# Altium schematic sheet Current_measurement.SchDoc
size A4; SheetNumber: 3; SheetTotal: 9; SPICEModelCacheJBRCZOZI: <root> / <DocumentId>JBRCZOZI</DocumentId> / <CacheFrame Number="0"> / <Model Name="mcp6001" Kind="CKT"> / <Text>.SUBCKT MCP6001 1 2 3 4 5 / *               | | | | | / *               | | | | Output / *               | | | Negative Supply / *               | | Positive Supply / *               | Inverting Input / *               Non-inverting Input / * / ******************************************************************************** / * Software License Agreement                                                   * / *                                                                              * / * The software supplied herewith by Microchip Technology Incorporated (the     * / * "Company") is intended and supplied to you, the Company's customer, for use  * / * soley and exclusively on Microchip products.                                 * / *                                                                              * / * The software is owned by the Company and/or its supplier, and is protected   * / * under applicable copyright laws. All rights are reserved. Any use in         * / * violation of the foregoing restrictions may subject the user to criminal     * / * sanctions under applicable laws, as well as to civil liability for the       * / * breach of the terms and conditions of this license.                          * / *                                                                              * / * THIS SOFTWARE IS PROVIDED IN AN "AS IS" CONDITION. NO WARRANTIES, WHETHER    * / * EXPRESS, IMPLIED OR STATUTORY, INCLUDING, BUT NOT LIMITED TO, IMPLIED        * / * WARRANTIES OF MERCHANTABILITY AND FITNESS FOR A PARTICULAR PURPOSE APPLY TO  * / * THIS SOFTWARE. THE COMPANY SHALL NOT, IN ANY CIRCUMSTANCES, BE LIABLE FOR    * / * SPECIAL, INCIDENTAL OR CONSEQUENTIAL DAMAGES, FOR ANY REASON WHATSOEVER.     * / ******************************************************************************** / * / * Macromodel for the MCP6001/2/4 op amp family: / *   MCP6001, MCP6001R, MCP6001U, MCP6002, MCP6004 / * / * Revision History: / *   REV A: 21-Jun-02, Created model / *   REV B: 16-Jul-02, Improved output stage / *   REV C: 03-Jan-03, Added MCP6001 / *   REV D: 19-Aug-06, Added over temperature, improved output stage, / *                     fixed overdrive recovery time / *   REV E: 27-Jul-07, Updated output impedance for better model stability w/cap load / *   REV F: 09-Jul-12, Added MCP6001R, MCP6001U / * / * Recommendations: / *   Use PSPICE (other simulators may require translation) / *   For a quick, effective design, use a combination of: data sheet / *     specs, bench testing, and simulations with this macromodel / *   For high impedance circuits, set GMIN=100F in .OPTIONS / * / * Supported: / *   Typical performance for temperature range (-40 to 125) degrees Celsius / *   DC, AC, Transient, and Noise analyses. / *   Most specs, including: offsets, DC PSRR, DC CMRR, input impedance, / *     open loop gain, voltage ranges, supply current, ... , etc. / *   Temperature effects for Ibias, Iquiescent, Iout short circuit / *   current, Vsat on both rails, Slew Rate vs. Temp and P.S. / * / * Not Supported: / *   Some Variation in specs vs. Power Supply Voltage / *   Monte Carlo (Vos, Ib), Process variation / *   Distortion (detailed non-linear behavior) / *   Behavior outside normal operating region / * / * Input Stage / V10  3 10 -500M / R10 10 11 6.90K / R11 10 12 6.90K / C11 11 12 0.2p / C12 1  0 6.00P / E12 71 14 POLY(4) 20 0 21 0 26 0 27 0   1.00M 20.1 20.1 1 1 / G12 1 0 62 0 1m / M12 11 14 15 15 NMI L=2.00U W=42.0U / M14 12  2 15 15 NMI L=2.00U W=42.0U / G14 2 0 62 0 1m / C14  2  0 6.00P / I15 15  4 50.0U / V16 16  4 -300M / GD16 16 1 TABLE {V(16,1)} ((-100,-1p)(0,0)(1m,1n)(2m,1m)(3m,1)) / V13  3 13 -300M / GD13 2 13 TABLE {V(2,13)} ((-100,-1p)(0,0)(1m,1n)(2m,1m)(3m,1)) / R70 1 0 20.6T / R71 2 0 20.6T / R72 1 2 20T / I80 1 2 0.5p / * / * Noise, PSRR, and CMRR / I20 21 20 423U / D20 20  0 DN1 / D21  0 21 DN1 / G26  0 26 POLY(1) 3 4   110U -49U / R26 26  0 1 / G27  0 27 POLY(2) 1 0 2 0   -440U 39.7U 39.7U / R27 27  0 1 / * / * Open Loop Gain, Slew Rate / G30  0 30 POLY(1) 12 11   0 1 / R30 30  0 1K / G31  0 31 POLY(1) 3 4 86 5.25 / R31 31  0 1 TC=2.8m / GD31 30 31 TABLE {V(30,31)} ((-11,-1)(-10,-10n)(0,0)(1m,1000)) / G32 32  0 POLY(1) 3 4 113.7 3.5 / R32 32  0 1 TC=2.65m / GD32 30 32 TABLE {V(30,32)} ((-1m,-1000)(0,0)(10,10n)(11,1)) / G33 0 33 30 0 1m / R33 33 0 1k / G34  0 34 33 0 425M / R34  34 0 1K / C34  34 0 74U / G37  0 37 34 0 1m / R37  37 0 1K / C37  37 0 41.6P / G38  0 38 37 0 1m / R38  39 0 1K / L38  38 39 100U / E38  35 0 38 0 1 / G35 33 0 TABLE {V(35,3)} ((-1,-1n)(0,0)(16,1n))(16.1,1)) / G36 33 0 TABLE {V(35,4)} ((-16.1,-1)((-16,-1n)(0,0)(1,1n)) / * / * Output Stage / R80 50 0 100MEG / G50 0 50 57 96 2 / R58 57  96 0.50 / R57 57  0 750 / C58  5  0 2.00P / G57  0 57 POLY(3) 3 0 4 0 35 0   0 0.67M 0.67M 1.5M / GD55 55 57 TABLE {V(55,57)} ((-2m,-1)(-1m,-1m)(0,0)(10,1n)) / GD56 57 56 TABLE {V(57,56)} ((-2m,-1)(-1m,-1m)(0,0)(10,1n)) / E55 55  0 POLY(2) 3 0 51 0 -0.7m 1 -40.0M / E56 56  0 POLY(2) 4 0 52 0 1.2m 1 -37.0M / R51 51 0 1k / R52 52 0 1k / GD51 50 51 TABLE {V(50,51)} ((-10,-1n)(0,0)(1m,1m)(2m,1)) / GD52 50 52 TABLE {V(50,52)} ((-2m,-1)(-1m,-1m)(0,0)(10,1n)) / G53  3  0 POLY(1) 51 0  -49U 1M / G54  0  4 POLY(1) 52 0  -49U -1M / * / * Current Limit / G99 96 5 99 0 1 / R98 0 98 1 TC=-2.8M,2.63U / G97 0 98 TABLE { V(96,5) } ((-11.0,-10.0M)(-1.00M,-9.9M)(0,0)(1.00M,9.9M)(11.0,10.0M)) / E97 99 0 VALUE { V(98)*((V(3)-V(4))*359M + 310M)} / D98 4 5 DESD / D99 5 3 DESD / * / * Temperature / Voltage Sensitive IQuiscent / R61 0 61 100 TC 3.11M 4.51U / G61 3 4 61 0 1 / G60 0 61 TABLE {V(3, 4)} / + ((0,0)(900M,0.0106U)(1.00,0.20U)(1.3,0.63U) / + (1.5,0.66U)(1.6,1.06U)(5.5,1.10U)) / * / * Temp Sensitive offset voltage / I73 0 70 DC 1uA / R74 0 70 1 TC=2 / E75 1 71 70 0 1 / * / * Temp Sensistive IBias / I62 0 62 DC 1uA / R62 0 62 REXP 58.2u / * Voltage on R62 used for G12, G14 in input stage / * / * Models / .MODEL NMI NMOS / .MODEL DESD  D   N=1 IS=1.00E-15 / .MODEL DL  D   N=1 IS=1F / .MODEL DN1 D   IS=1P KF=146E-18 AF=1 / .MODEL REXP RES TCE=10.1 / .ENDS MCP6001</Text> / </Model> / <Model Name="smk316b7103_f-t" Kind="CKT"> / <Text>* SMK316B7103_F-T     SPICE MODEL  ( General Type ) / *-------------------------------------------------------------------------------------------------------- / * Model Generated by TAIYO YUDEN Corporation (http://www.ty-top.com) / * Version 1.0 / * TAIYO YUDEN Control No. 170508_161201 / * Copyright(c) 2012 TAIYO YUDEN CO.,LTD. All Rights Reserved. / *-------------------------------------------------------------------------------------------------------- / * / * Products Name : Multilayer Ceramic Capacitors / * / * Characteristics : / *     Capacitance : 0.01 uF , Rated Voltage : 630V , TCC : X7R / *     Case Size : 3.2 x 1.6 / 0.126 x 0.063 [mm/inch] , Thickness : 1.15 / 0.045 [mm/inch] / *     (Conditions: Temperature = 25 degC , DC Bias Current/Voltage = 0A / 0V) / * / * Frequency Range : 40Hz - 3GHz / * / * External Node Assignments : / * / *  1  o---| |---o  2 / * / *-------------------------------------------------------------------------------------------------------- / .SubCkt SMK316B7103_F-T 1 2 / **************************** / C0 1 110 9888p / Cm 1 101 398.4p / C1 101 102 1923.4p / Rc1 101 102 288.22k / C2 102 103 1016.2p / Rc2 102 103 14.114k / C3 103 110 4.0985p / Rc3 103 110 430.45 / C2m 1 301 429.64p / C21 301 302 0.05831u / Rc21 301 302 274.72k / C22 302 303 5474.8p / Rc22 302 303 613.52k / C23 303 304 3415.7p / Rc23 303 304 754.71k / C24 304 305 2829.6p / Rc24 304 305 45.094k / C25 305 306 1811.9p / Rc25 305 306 41.061k / C26 306 307 1276.1p / Rc26 306 307 2.7245k / C27 307 308 180.55p / Rc27 307 308 2.1125k / C28 308 309 583.2p / Rc28 308 309 516.69 / C29 309 110 1.724p / Rc29 309 110 368.87 / Rp0 1 110 10G / L0 110 120 0.45307n / Lm 120 130 0.21245n / L1 120 121 3.2969p / RL1 121 130 33.569 / L2 120 122 0.53999n / RL2 122 130 0.49892 / L3 120 123 3.1666n / RL3 123 130 4.2853 / CR 120 124 1050.7p / LR 124 125 0.2527n / RR 125 130 0.40977 / CL 130 140 7.2948p / LL 130 140 0.31535n / RL 130 140 12.803 / Rs 140 2 57.335m / **************************** / .ends SMK316B7103_F-T</Text> / </Model> / <Model Name="qmk325bj104_n-t" Kind="CKT"> / <Text>* QMK325BJ104_N-T     SPICE MODEL  ( General Type ) / *-------------------------------------------------------------------------------------------------------- / * Model Generated by TAIYO YUDEN Corporation (http://www.ty-top.com) / * Version 1.0 / * TAIYO YUDEN Control No. 170508_101215 / * Copyright(c) 2012 TAIYO YUDEN CO.,LTD. All Rights Reserved. / *-------------------------------------------------------------------------------------------------------- / * / * Products Name : Multilayer Ceramic Capacitors / * / * Characteristics : / *     Capacitance : 0.1 uF , Rated Voltage : 250V , TCC : B / X5R / *     Case Size : 3.2 x 2.5 / 0.126 x 0.098 [mm/inch] , Thickness : 1.9 / 0.075 [mm/inch] / *     (Conditions: Temperature = 25 degC , DC Bias Current/Voltage = 0A / 0V) / * / * Frequency Range : 40Hz - 3GHz / * / * External Node Assignments : / * / *  1  o---| |---o  2 / * / *-------------------------------------------------------------------------------------------------------- / .SubCkt QMK325BJ104_N-T 1 2 / **************************** / C0 1 110 0.09559u / Cm 1 101 3751.1p / C1 101 102 0.015822u / Rc1 101 102 51.629k / C2 102 103 7648.8p / Rc2 102 103 3.8642k / C3 103 110 450.5p / Rc3 103 110 113.97 / C2m 1 301 3919.2p / C21 301 302 0.035457u / Rc21 301 302 241.74k / C22 302 303 0.036825u / Rc22 302 303 156.05k / C23 303 304 0.038127u / Rc23 303 304 141.7k / C24 304 305 0.017837u / Rc24 304 305 8.8244k / C25 305 306 0.016301u / Rc25 305 306 9.1046k / C26 306 307 0.010066u / Rc26 306 307 717.43 / C27 307 308 1390.3p / Rc27 307 308 682.39 / C28 308 309 8928.6p / Rc28 308 309 84.912 / C29 309 110 13.208p / Rc29 309 110 119.07 / Rp0 1 110 1G / L0 110 120 0.24814n / Lm 120 130 0.27661n / RL1 120 130 181.88 / L2 120 122 0.76576n / RL2 122 130 0.73015 / L3 120 123 1.0444n / RL3 123 130 1.0157 / CR 120 124 0.022178u / LR 124 125 0.21869n / RR 125 130 0.15853 / CL 130 140 13.866p / LL 130 140 0.20298n / RL 130 140 8.1514 / Rs 140 2 13.921m / **************************** / .ends QMK325BJ104_N-T</Text> / </Model> / <Model Name="ntc_10k_1" Kind="CKT"> / <Text>.SUBCKT NTC_10K_1   1 2   4 5 / ETHERM 1 3 VALUE = { I(VSENSE)*10K*EXP( 3548/(V(4,5)+273) - 3548/(25+273) ) } / VSENSE 3 2 DC 0 / .ENDS</Text> / </Model> / </CacheFrame> / </root>
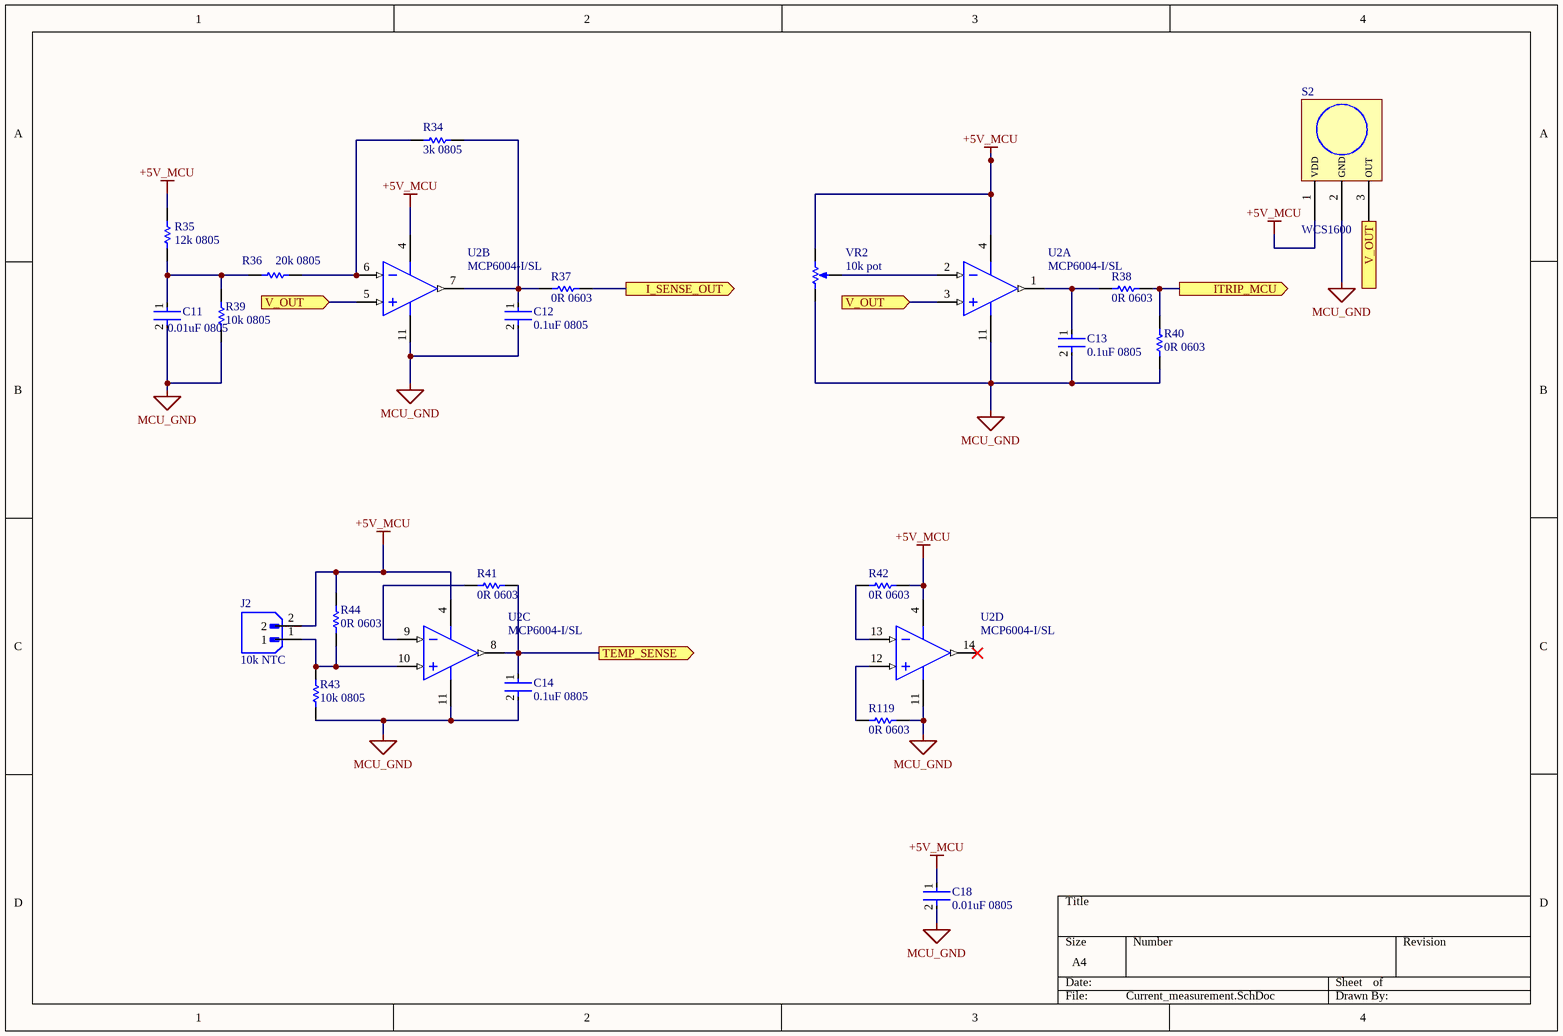
[diagram p0: Current_measurement.SchDoc]

## Parts
C11  0.01uF 0805  [R0805]
C12  0.1uF 0805  [R0805]
C13  0.1uF 0805  [R0805]
C14  0.1uF 0805  [R0805]
C18  0.01uF 0805  [R0805]
J2  10k NTC  [XH2.5-2p]
R34  3k 0805  [R0805]
R35  12k 0805  [R0805]
R36  20k 0805  [R0805]
R37  0R 0603  [R0603]
R38  0R 0603  [R0603]
R39  10k 0805  [R0805]
R40  0R 0603  [R0603]
R41  0R 0603  [R0603]
R42  0R 0603  [R0603]
R43  10k 0805  [R0805]
R44  0R 0603  [R0603]
R119  0R 0603  [R0603]
S2  WCS1600  [WCS1600]
U2  MCP6004-I/SL  [SOIC-SL14_M]  (parts A,B,C,D of 4)
VR2  10k pot  [BOUR-3299W-3_V]

## Ports
I_SENSE_OUT (out), ITRIP_MCU (out), TEMP_SENSE (out), V_OUT (in), V_OUT (out)

## Nets
+5V_MCU: C18.1 J2.2 R35.2 R42.2 R44.2 S2.1(VDD) U2.4(VDD) VR2.1(CCW)
MCU_GND: C11.2 C12.2 C13.2 C14.2 C18.2 R39.1 R40.1 R43.1 R119.2 S2.2(GND) U2.11(VSS) VR2.3(CW)
I_SENSE_OUT: R37.2 ; port I_SENSE_OUT
ITRIP_MCU: R38.2 R40.2 ; port ITRIP_MCU
TEMP_SENSE: C14.1 R41.2 U2.8(VOUTC) ; port TEMP_SENSE
V_OUT: S2.3(OUT) U2.3(VINA+) U2.5(VINB+) ; port V_OUT
NetC11_1: C11.1 R35.1 R36.1 R39.2
NetC12_1: C12.1 R34.2 R37.1 U2.7(VOUTB)
NetC13_1: C13.1 R38.1 U2.1(VOUTA)
NetJ2_1: J2.1 R43.2 R44.1 U2.10(VINC+)
NetR34_1: R34.1 R36.2 U2.6(VINB-)
NetR41_1: R41.1 U2.9(VINC-)
NetR42_1: R42.1 U2.13(VIND-)
NetR119_1: R119.1 U2.12(VIND+)
NetU2_2: U2.2(VINA-) VR2.2(WIPER)

Not connected (* = marked no-connect by the designer): U2 14(VOUTD)*

## Library data of the parts
C11 C18 = 0.01uF 0805: 10nF/0.01uF 50V Capacitor ±10% Tolerance 0805B103K500CT – 0805 Package; Product URL: https://sharvielectronics.com/product/10nf-0-01uf-50v-capacitor-%c2%b110-tolerance-0805b103k500ct-0805-package/; Price per piece: 2.45; Datasheet: https://drive.google.com/file/d/18RHnvRuuuVekgJyOA4l8O3UUaSpuKbHR/view?usp=sharing
C12-C14 = 0.1uF 0805: 0.1uF/100nF 100V Capacitor ±10% Tolerance CC0805KKX7R0BB104 – 0805 Package; Product URL: https://sharvielectronics.com/product/0-1uf-100nf-100v-capacitor-%c2%b110-tolerance-cc0805kkx7r0bb104-0805-package/; Price per piece: 4.76; Datasheet: https://drive.google.com/file/d/1wr2K_YaGqgMtACeU2pC6RWLSxDMrIPxr/view?usp=sharing
J2 = XH2.5-2p: 2 Pin JST-XH Male Straight 2515 Connector 2.54mm Pitch; Price per piece: 1.65; Product URL: https://sharvielectronics.com/product/2-pin-jst-xh-male-straight-2515-connector-2-54mm-pitch/; Datasheet: https://sharvielectronics.com/wp-content/uploads/2021/01/XH-Connector.pdf
R34 = R0805: 3K Ohm 1/8 Watt Resistor 1% Tolerance 0805W8F3001T5E – 0805 Package; Price per piece: 0.82; Product URL: https://sharvielectronics.com/product/3k-ohm-1-8-watt-resistor-1-tolerance-0805w8f3001t5e-0805-package/; Datasheet: https://drive.google.com/file/d/1rtx85iFJaMrDbsv7PAzG9bTFItPmAE38/view?usp=sharing
R35 = R0805: 12K Ohm 1/8 Watt Resistor 1% Tolerance RC0805FR-0712KL – 0805 Package; Price per piece: 0.93; Product URL: https://sharvielectronics.com/product/12k-ohm-1-8-watt-resistor-1-tolerance-rc0805fr-0712kl-0805-package/; Datasheet: https://drive.google.com/file/d/1pkLQT_RQ1i35oFQcGREpZr7Oy3Ppi-ZT/view?usp=sharing
R36 = R0805: 20K ohm 1/8 Watt SMD Resistor 1% Tolerance RC0805FR-0720KL – 0805 Package; Price per piece: 1.15; Product URL: https://sharvielectronics.com/product/20k-ohm-1-8-watt-smd-resistor-1-tolerance-rc0805fr-0720kl-0805-package/; Datasheet: https://drive.google.com/file/d/1pkLQT_RQ1i35oFQcGREpZr7Oy3Ppi-ZT/view?usp=sharing
R37 R38 R40-R42 R44 R119 = R0000 0603: 0 Ohm 1/10 Watt Resistor 1% Tolerance RC0603FR-070RL – 0603 Package; Price per piece: 0.97; Product URL: https://sharvielectronics.com/product/0-ohm-1-10-watt-resistor-1-tolerance-rc0603fr-070rl-0603-package/; Datasheet: https://drive.google.com/file/d/1pkLQT_RQ1i35oFQcGREpZr7Oy3Ppi-ZT/view?usp=sharing
R39 R43 = 10k 0805: 10K Ohm 1/8 Watt Resistor 1% Tolerance RC0805FR-0710KL – 0805 Package; Price per piece: 0.82; Product URL: https://sharvielectronics.com/product/10k-ohm-1-8-watt-resistor-1-tolerance-rc0805fr-0710kl-0805-package/; Datasheet: https://drive.google.com/file/d/1pkLQT_RQ1i35oFQcGREpZr7Oy3Ppi-ZT/view?usp=sharing
S2 = WCS1600: WCS1600 100A Hall Effect Linear Current Sensor; Price per piece: 280.67; Product URL: https://sharvielectronics.com/product/wcs1600-100a-hall-effect-linear-current-sensor/; Datasheet: https://sharvielectronics.com/wp-content/uploads/2020/02/WCS1600.pdf
U2 = CMP-0187-00321-3: MCP6004 1MHz Rail-to-Rail Operational Amplifier – SOIC-14 Package; Number of Channels: 4; Amplifier Type: GENERAL PURPOSE; Common Mode Rejection Ratio: 60dB; Voltage Gain: 112dB; Min Supply Voltage: 1.8V; Slew Rate-Nom: 0.6V/µs; Supply Current: 100uA; Input Offset Voltage-Max: 4.5mV; Power Supply Rejection Ratio (PSRR): 86dB; Output Current: 23mA; Operating Supply Voltage: 5.5V; Input Bias Current: 1pA; Max Supply Voltage: 6V; RoHS Compliant: Yes; Technology: CMOS; Radiation Hardening: No; Bandwidth: 1MHz; Number of Elements: 4; REACH SVHC: No SVHC; Number of Amplifiers: 4; Lead Free: Lead Free; Contact Plating: Tin; Max Operating Temperature: 85°C; Packaging: Rail/Tube; Number of Pins: 14; Case/Package: SOIC; Width: 3.9mm; Length: 8.65mm; Unity Gain Bandwidth Product: 1MHz; Gain Bandwidth Product: 1MHz; Input Offset Voltage (Vos): 4.5mV; Package Quantity: 57; Number of Circuits: 4; Min Operating Temperature: -40°C; Nominal Supply Current: 100uA; Height: 1.25mm; Slew Rate: 0.6V/µs; Mount: Surface Mount
VR2 = CMP-2000-05078-1: 10K ohm Variable Resistor-Trimpot 3296 Package; Brand: Bourns; Power Rating: 500mW(1/2W); Unit Weight: 0.035000oz; Qualification: Commercial; Element Type: Cermet; Resistance: 10kOhms; Tolerance: 10%; Temperature Coefficient: 100PPM/C; Voltage Rating: 300V; Adjustment: TopCrossed; Product: Multiturn; Datasheet Version: Sep-04; Datasheet URL: https://datasheet.ciiva.com/19482/769696-19482212.pdf; RoHS: True; Tradename: Trimpot; Product Type: SquareTrimmingPotentiometer; Mounting: PanelMount; Packaging: Tube; Package Reference: 3299W; Operating Temperature Range: -55Cto+125C; Length: 10.03mm; Termination Style: Pin; Manufacturer: Bourns; Manufacturer URL: http://www.bourns.com/; Product Category: TrimmerResistors-ThroughHole; Width: 9.53mm; Taper: Linear; Package Description: 3-Pin Surface Mount Device, Body 9.53 x 6.1 mm, Pitch 2.54 mm; Type: Trimmers; Series: 3299; Product URL: https://sharvielectronics.com/product/10k-ohm-variable-resistor-trimpot-3296-package/; Price per piece: 11.23; Datasheet: https://sharvielectronics.com/wp-content/uploads/2020/06/50K-ohm-Variable-Resistor-Trimpot-3296-Package.pdf